# EAGLE design tinyfoc_dual (EAGLE 9.6.2)
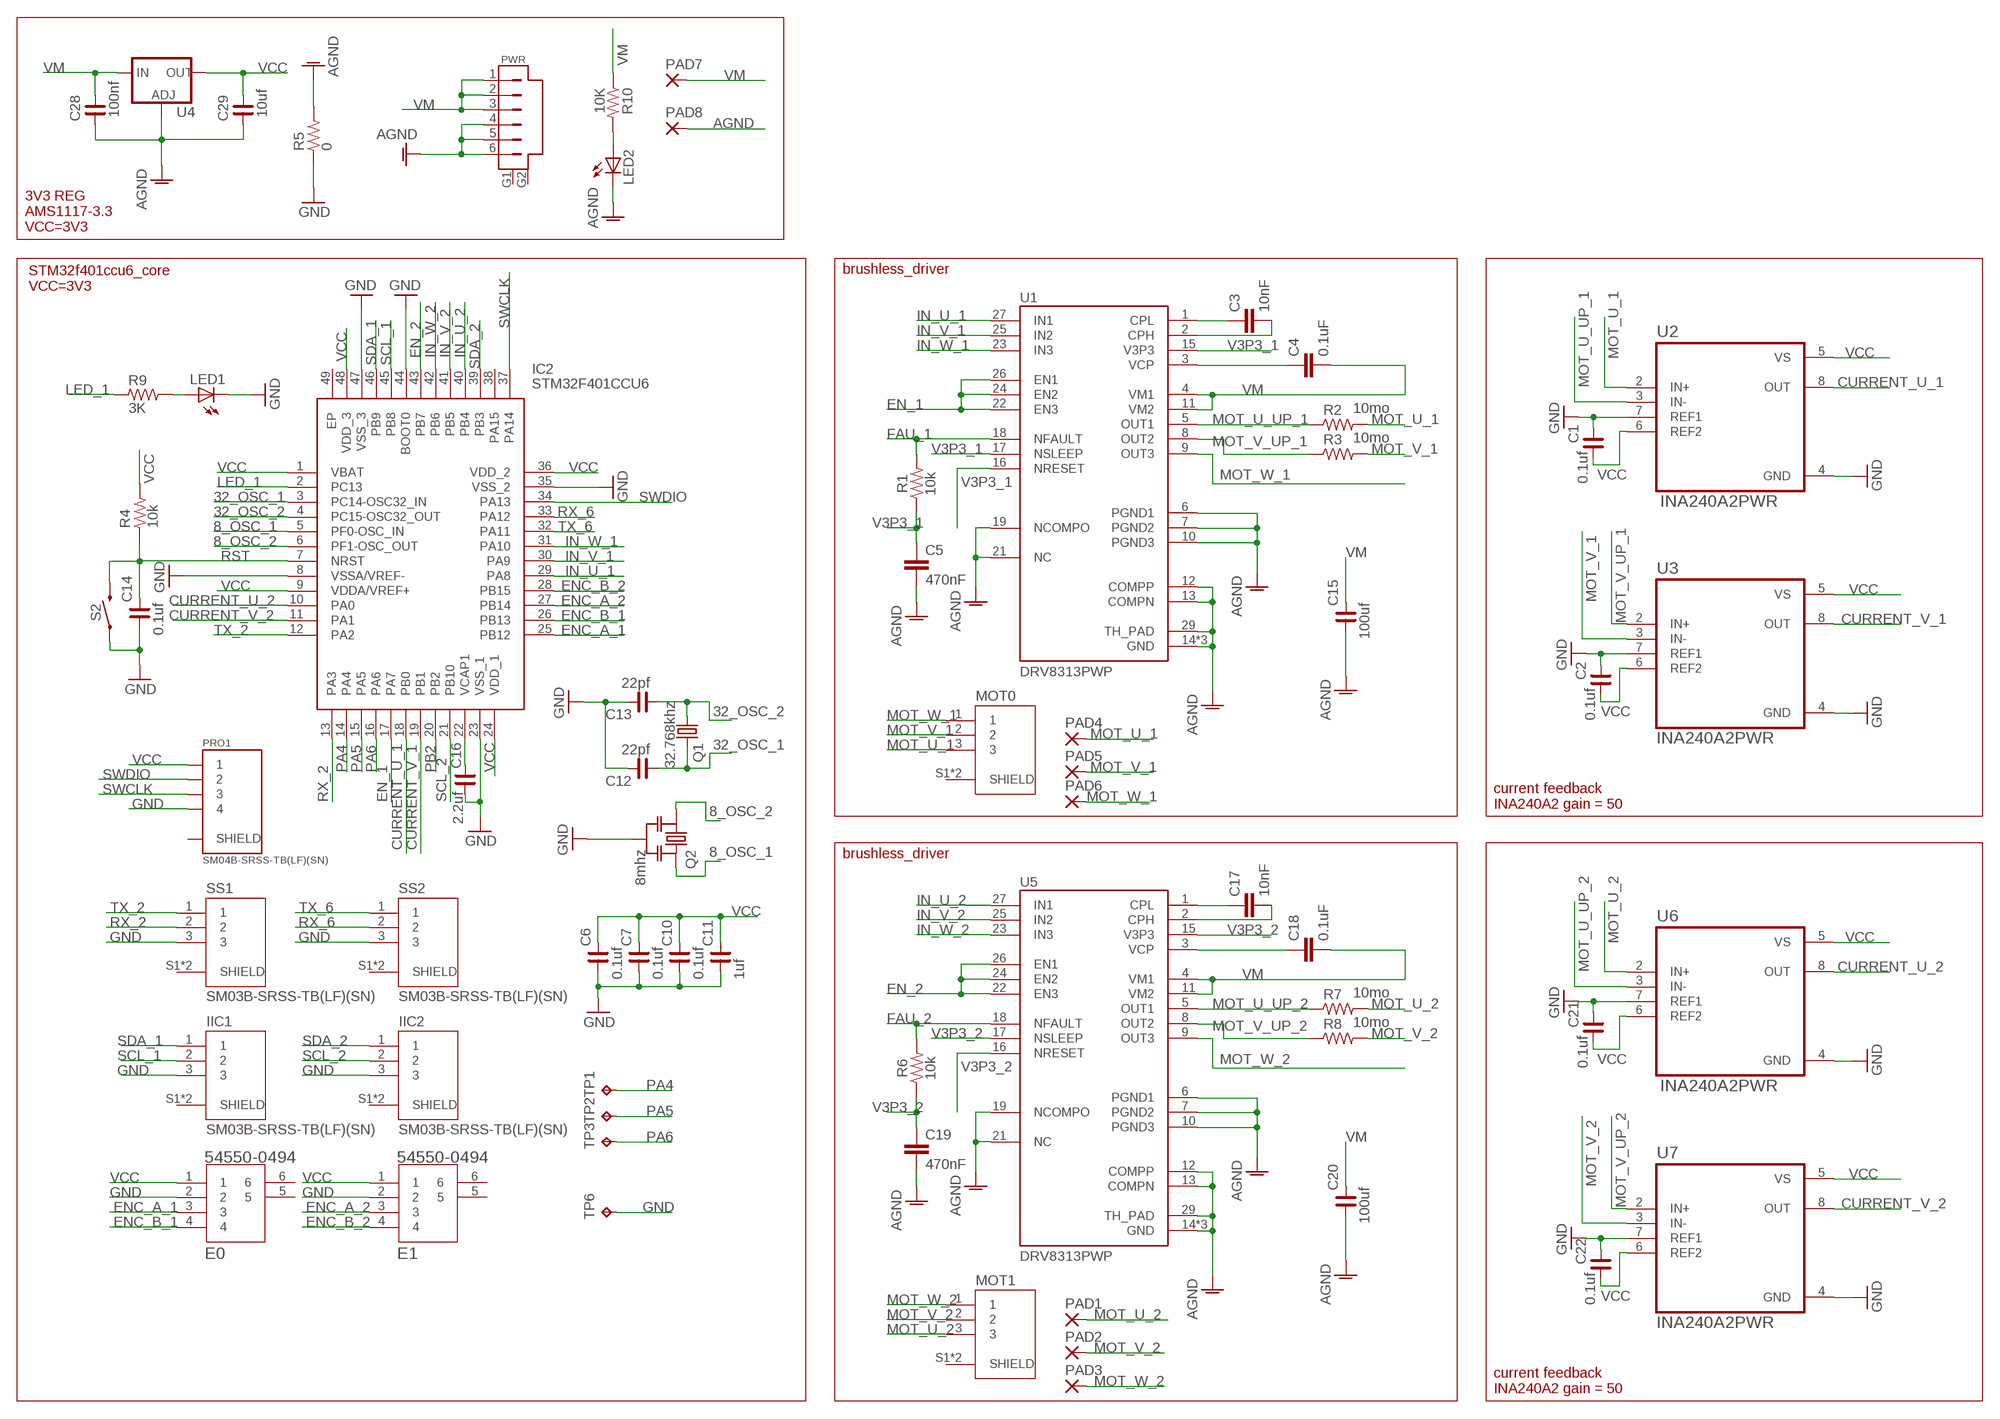
[diagram p0: schematic, sheet 1]

## Parts
C1  0.1uf  C_0603  [C0603]
C2  0.1uf  C_0603  [C0603]
C3  10nF  10NF-0603-50V-10%  [0603]
C4  0.1uF  0.1UF-0603-25V-(+80/-20%)  [0603]
C5  470nF  470NF-0603-10V-10%-X5R  [0603]
C6  0.1uf  C_0603  [C0603]
C7  0.1uf  C_0603  [C0603]
C10  0.1uf  C_0603  [C0603]
C11  1uf  C_0603  [C0603]
C12  22pf  C_0603  [C0603]
C13  22pf  C_0603  [C0603]
C14  0.1uf  C_0603  [C0603]
C15  100uf  C_1206  [C1206]
C16  2.2uf  C_0603  [C0603]
C17  10nF  10NF-0603-50V-10%  [0603]
C18  0.1uF  0.1UF-0603-25V-(+80/-20%)  [0603]
C19  470nF  470NF-0603-10V-10%-X5R  [0603]
C20  100uf  C_1206  [C1206]
C21  0.1uf  C_0603  [C0603]
C22  0.1uf  C_0603  [C0603]
C28  100nf  C_0603  [C0603]
C29  10uf  C_0603  [C0603]
E0  54550-0494  [CON4_1X4_DRB2_MOL]
E1  54550-0494  [CON4_1X4_DRB2_MOL]
IC2  STM32F401CCU6  [QFN50P700X700X60-49N]
IIC1  SM03B-SRSS-TB(LF)(SN)  [JST_SM03B-SRSS-TB(LF)(SN)]
IIC2  SM03B-SRSS-TB(LF)(SN)  [JST_SM03B-SRSS-TB(LF)(SN)]
LED1  LEDCHIPLED_0603  [CHIPLED_0603]
LED2  LEDCHIPLED_0603  [CHIPLED_0603]
MOT0  SM03B-SRSS-TB(LF)(SN)  [JST_SM03B-SRSS-TB(LF)(SN)]
MOT1  SM03B-SRSS-TB(LF)(SN)  [JST_SM03B-SRSS-TB(LF)(SN)]
PAD1  SMD5  [SMD2,54-5,08]
PAD2  SMD5  [SMD2,54-5,08]
PAD3  SMD5  [SMD2,54-5,08]
PAD4  SMD5  [SMD2,54-5,08]
PAD5  SMD5  [SMD2,54-5,08]
PAD6  SMD5  [SMD2,54-5,08]
PAD7  SMD5  [SMD2,54-5,08]
PAD8  SMD5  [SMD2,54-5,08]
PRO1  SM04B-SRSS-TB(LF)(SN)  [JST_SM04B-SRSS-TB(LF)(SN)]
PWR  SM06B-SRSS-TB  [SM06B]
Q1  32.768khz  KX-327-NHF  [3.2X1.5]
Q2  8mhz  RESONATOR-MURATACST_CE  [RESONATOR_MURATA2]
R1  10k  10KOHM-0603-1/10W-1%  [0603]
R2  10mo  R_1206  [R1206]
R3  10mo  R_1206  [R1206]
R4  10k  R_0603  [R0603]
R5  0  R_0603  [R0603]
R6  10k  10KOHM-0603-1/10W-1%  [0603]
R7  10mo  R_1206  [R1206]
R8  10mo  R_1206  [R1206]
R9  3K  R_0603  [R0603]
R10  10K  R_0603  [R0603]
S2  MOMENTARY-SWITCH-SPST-SMD-RIGHT-ANGLE  [TACTILE_SWITCH_SMD_RIGHT_ANGLE]
SS1  SM03B-SRSS-TB(LF)(SN)  [JST_SM03B-SRSS-TB(LF)(SN)]
SS2  SM03B-SRSS-TB(LF)(SN)  [JST_SM03B-SRSS-TB(LF)(SN)]
TP1  TPTP14SQ  [TP14SQ]
TP2  TPTP14SQ  [TP14SQ]
TP3  TPTP14SQ  [TP14SQ]
TP6  TPTP14SQ  [TP14SQ]
U1  DRV8313PWP  [SOP28P65_970X640X120L60X24T483X275N]
U2  INA240A2PWR  [SOP65P640X120-8N]
U3  INA240A2PWR  [SOP65P640X120-8N]
U4  V_REG_LM1117SOT223  [SOT223]
U5  DRV8313PWP  [SOP28P65_970X640X120L60X24T483X275N]
U6  INA240A2PWR  [SOP65P640X120-8N]
U7  INA240A2PWR  [SOP65P640X120-8N]

## Nets
8_OSC_1: IC2.5(PF0-OSC_IN) Q2.3
8_OSC_2: IC2.6(PF1-OSC_OUT) Q2.1
32_OSC_1: C12.1 IC2.3(PC14-OSC32_IN) Q1.2
32_OSC_2: C13.1 IC2.4(PC15-OSC32_OUT) Q1.1
AGND: C5.2 C15.1 C19.2 C20.1 C28.1 C29.1 LED2.C PAD8.1(P) PWR.4 PWR.5 PWR.6 R5.2 U1.6(PGND1) U1.7(PGND2) U1.10(PGND3) U1.12(COMPP) U1.13(COMPN) U1.14(GND) U1.19(NCOMPO) U1.20(GND) U1.21(NC) U1.28(GND) U1.29(TH_PAD) U4.1(ADJ) U5.6(PGND1) U5.7(PGND2) U5.10(PGND3) U5.12(COMPP) U5.13(COMPN) U5.14(GND) U5.19(NCOMPO) U5.20(GND) U5.21(NC) U5.28(GND) U5.29(TH_PAD)
CURRENT_U_1: IC2.18(PB0) U2.8(OUT)
CURRENT_U_2: IC2.10(PA0) U6.8(OUT)
CURRENT_V_1: IC2.19(PB1) U3.8(OUT)
CURRENT_V_2: IC2.11(PA1) U7.8(OUT)
EN_1: IC2.17(PA7) U1.22(EN3) U1.24(EN2) U1.26(EN1)
EN_2: IC2.43(PB7) U5.22(EN3) U5.24(EN2) U5.26(EN1)
ENC_A_1: E0.3 IC2.25(PB12)
ENC_A_2: E1.3 IC2.27(PB14)
ENC_B_1: E0.4 IC2.26(PB13)
ENC_B_2: E1.4 IC2.28(PB15)
FAU_1: R1.2 U1.18(NFAULT)
FAU_2: R6.2 U5.18(NFAULT)
GND: C1.2 C2.2 C6.1 C7.1 C10.1 C11.1 C12.2 C13.2 C14.1 C16.1 C21.2 C22.2 E0.2 E1.2 IC2.8(VSSA/VREF-) IC2.23(VSS_1) IC2.35(VSS_2) IC2.44(BOOT0) IC2.47(VSS_3) IIC1.3 IIC2.3 LED1.C PRO1.4 Q2.2 R5.1 S2.1 SS1.3 SS2.3 TP6.TP U2.4(GND) U2.7(REF1) U3.4(GND) U3.7(REF1) U6.4(GND) U6.7(REF1) U7.4(GND) U7.7(REF1)
IN_U_1: IC2.29(PA8) U1.27(IN1)
IN_U_2: IC2.40(PB4) U5.27(IN1)
IN_V_1: IC2.30(PA9) U1.25(IN2)
IN_V_2: IC2.41(PB5) U5.25(IN2)
IN_W_1: IC2.31(PA10) U1.23(IN3)
IN_W_2: IC2.42(PB6) U5.23(IN3)
LED_1: IC2.2(PC13) R9.1
MOT_U_1: MOT0.3 PAD4.1(P) R2.2 U2.2(IN+)
MOT_U_2: MOT1.3 PAD1.1(P) R7.2 U6.2(IN+)
MOT_U_UP_1: R2.1 U1.5(OUT1) U2.3(IN-)
MOT_U_UP_2: R7.1 U5.5(OUT1) U6.3(IN-)
MOT_V_1: MOT0.2 PAD5.1(P) R3.2 U3.3(IN-)
MOT_V_2: MOT1.2 PAD2.1(P) R8.2 U7.3(IN-)
MOT_V_UP_1: R3.1 U1.8(OUT2) U3.2(IN+)
MOT_V_UP_2: R8.1 U5.8(OUT2) U7.2(IN+)
MOT_W_1: MOT0.1 PAD6.1(P) U1.9(OUT3)
MOT_W_2: MOT1.1 PAD3.1(P) U5.9(OUT3)
N$1: C16.2 IC2.22(VCAP1)
N$2: C17.1 U5.1(CPL)
N$3: C3.1 U1.1(CPL)
N$4: C3.2 U1.2(CPH)
N$5: C4.1 U1.3(VCP)
N$6: LED2.A R10.2
N$7: C17.2 U5.2(CPH)
N$8: C18.1 U5.3(VCP)
N$9: LED1.A R9.2
PA4: IC2.14(PA4) TP1.TP
PA5: IC2.15(PA5) TP2.TP
PA6: IC2.16(PA6) TP3.TP
PB2: IC2.20(PB2)
RST: C14.2 IC2.7(NRST) R4.1 S2.2
RX_2: IC2.13(PA3) SS1.2
RX_6: IC2.33(PA12) SS2.2
SCL_1: IC2.45(PB8) IIC1.2
SCL_2: IC2.21(PB10) IIC2.2
SDA_1: IC2.46(PB9) IIC1.1
SDA_2: IC2.39(PB3) IIC2.1
SWCLK: IC2.37(PA14) PRO1.3
SWDIO: IC2.34(PA13) PRO1.2
TX_2: IC2.12(PA2) SS1.1
TX_6: IC2.32(PA11) SS2.1
V3P3_1: C5.1 R1.1 U1.15(V3P3) U1.16(NRESET) U1.17(NSLEEP)
V3P3_2: C19.1 R6.1 U5.15(V3P3) U5.16(NRESET) U5.17(NSLEEP)
VCC: C1.1 C2.1 C6.2 C7.2 C10.2 C11.2 C21.1 C22.1 C29.2 E0.1 E1.1 IC2.1(VBAT) IC2.9(VDDA/VREF+) IC2.24(VDD_1) IC2.36(VDD_2) IC2.48(VDD_3) PRO1.1 R4.2 U2.5(VS) U2.6(REF2) U3.5(VS) U3.6(REF2) U4.2(OUT) U4.4(OUT) U6.5(VS) U6.6(REF2) U7.5(VS) U7.6(REF2)
VM: C4.2 C15.2 C18.2 C20.2 C28.2 PAD7.1(P) PWR.1 PWR.2 PWR.3 R10.1 U1.4(VM1) U1.11(VM2) U4.3(IN) U5.4(VM1) U5.11(VM2)
Unconnected: E0.5 E0.6 E1.5 E1.6 IC2.38(PA15) IC2.49(EP) IIC1.S1(SHIELD) IIC1.S2(SHIELD) IIC2.S1(SHIELD) IIC2.S2(SHIELD) MOT0.S1(SHIELD) MOT0.S2(SHIELD) MOT1.S1(SHIELD) MOT1.S2(SHIELD) PRO1.S1(SHIELD) PRO1.S2(SHIELD) PWR.G1 PWR.G2 SS1.S1(SHIELD) SS1.S2(SHIELD) SS2.S1(SHIELD) SS2.S2(SHIELD)

## Notes on the sheet
- 3V3 REG
  AMS1117-3.3
  VCC=3V3
- brushless_driver
- STM32f401ccu6_core
  VCC=3V3
- current feedback
  INA240A2 gain = 50
- brushless_driver
- current feedback
  INA240A2 gain = 50

## Library data of the parts
C1 C2 C6 C7 C10-C16 C20-C22 C28 C29 = rc-master-smd:C_: NON-POLARIZED CAP
C3 C17 = SparkFun-Capacitors:10NF: 0.01uF/10nF/10,000pF ceramic capacitors A capacitor is a passive two-terminal electrical component used to store electrical energy temporarily in an electric field. CAP-09321; PROD_ID: CAP-00867
C4 C18 = SparkFun-Capacitors:0.1UF: 0.1µF ceramic capacitors A capacitor is a passive two-terminal electrical component used to store electrical energy temporarily in an electric field.; PROD_ID: CAP-00810
C5 C19 = SparkFun-Capacitors:470NF: 0.47uF/470nF ceramic capacitors A capacitor is a passive two-terminal electrical component used to store electrical energy temporarily in an electric field.; PROD_ID: CAP-13216
E0 E1 = fpc_4p_0.5:54550-0494; BUILT_BY: EMA_UL_Team; MANUFACTURER_PART_NUMBER: 54550-0494; SOURCELIBRARY: Molex_2010-01-01; VENDOR: Molex Connector Corporation
IC2 = STM32F401CCU6:STM32F401CCU6: 32-Bit MCU Cortex-M4 256KB 1.8V UFQFPN48 STMicroelectronics STM32F401CCU6, 32bit ARM Cortex M4 MCU, 84MHz, 256 kB Flash, 48-Pin UFQFPN Source: Datasheet <http://www.st.com/web/en/resource/technical/document/datasheet/DM00086815.pdf>; ARROW_PART_NUMBER: STM32F401CCU6; ARROW_PRICE-STOCK: https://www.arrow.com/en/products/stm32f401ccu6/stmicroelectronics?region=nac; DESCRIPTION: 32-Bit MCU Cortex-M4 256KB 1.8V UFQFPN48 STMicroelectronics STM32F401CCU6, 32bit ARM Cortex M4 MCU, 84MHz, 256 kB Flash, 48-Pin UFQFPN; HEIGHT: 0.6mm; MANUFACTURER_NAME: STMicroelectronics; MANUFACTURER_PART_NUMBER: STM32F401CCU6; MOUSER_PART_NUMBER: 511-STM32F401CCU6; MOUSER_PRICE-STOCK: https://www.mouser.co.uk/ProductDetail/STMicroelectronics/STM32F401CCU6?qs=DqCdCwOw4%2F5VrOZQxO795A%3D%3D
IIC1 IIC2 MOT0 MOT1 SS1 SS2 = SM03B-SRSS-TB_LF__SN_:SM03B-SRSS-TB(LF)(SN): SH Series 3 Position 1 mm Pitch Surface Mount Side Entry Shrouded Header; AVAILABILITY: Unavailable; DESCRIPTION: Connector Header Surface Mount, Right Angle 3 position 0.039 _1.00mm_; MF: JST Sales; MP: SM03B-SRSS-TB_LF__SN_; PACKAGE: None; PRICE: None
LED1 LED2 = adafruit:LED: LED OSRAM: - CHIPLED LG R971, LG N971, LY N971, LG Q971, LY Q971, LO R971, LY R971 LH N974, LH R974 LS Q976, LO Q976, LY Q976 LO Q996 - Hyper CHIPLED LW Q18S LB Q993, LB Q99A, LB R99A - SideLED LS A670, LO A670, LY A670, LG A670, LP A670 LB A673, LV A673, LT A673, LW A673 LH A674 LY A675 LS A676, LA A676, LO A676, LY A676, LW A676 LS A679, LY A679, LG A679 - Hyper Micro SIDELED® LS Y876, LA Y876, LO Y876, LY Y876 LT Y87S - SmartLED LW L88C, LW L88S LB L89C, LB L89S, LG L890 LS L89K, LO L89K, LY L89K LS L896, LA L896, LO L896, LY L896 - TOPLED LS T670, LO T670, LY T670, LG T670, LP T670 LSG T670, LSP T670, LSY T670, LOP T670, LYG T670 LG T671, LOG T671, LSG T671 LB T673, LV T673, LT T673, LW T673 LH T674 LS T676, LA T676, LO T676, LY T676, LB T676, LH T676, LSB T676, LW T676 LB T67C, LV T67C, LT T67C, LS T67K, LO T67K, LY T67K, LW E67C LS E67B, LA E67B, LO E67B, LY E67B, LB E67C, LV E67C, LT E67C LW T67C LS T679, LY T679, LG T679 LS T770, LO T770, LY T770, LG T770, LP T770 LB T773, LV T773, LT T773, LW T773 LH T774 LS E675, LA E675, LY E675, LS T675 LS T776, LA T776, LO T776, LY T776, LB T776 LHGB T686 LT T68C, LB T68C - Hyper Mini TOPLED® LB M676 - Mini TOPLED Santana® LG M470 LS M47K, LO M47K, LY M47K Source: http://www.osram.convergy.de/
PAD1-PAD8 = wirepad:SMD5: SMD PAD
PRO1 = SM04B-SRSS-TB_LF__SN_:SM04B-SRSS-TB(LF)(SN): SH Series 1.0 mm Pitch 2 Position Single Row Side Entry Shrouded Header Check prices <https://snapeda.com/parts/SM04B-SRSS-TB%28LF%29%28SN%29/JST%20Sales/view-part/?ref=eda>; ARROW_EUROPE-PURCHASE-URL: https://snapeda.com/shop?store=Arrow+Europe&id=557466; AVAILABILITY: Good; DESCRIPTION: Connector Header Surface Mount, Right Angle 4 position 0.039 (1.00mm); DIGIKEY-PURCHASE-URL: https://snapeda.com/shop?store=DigiKey&id=557466; MF: JST Sales; MP: SM04B-SRSS-TB(LF)(SN); PACKAGE: None; PRICE: None
PWR = SM06B-SRSS-TB:SM06B-SRSS-TB: CONN HEADER SH 6POS SIDE 1MM TIN Check prices <https://snapeda.com/parts/SM06B-SRSS-TB/JST%20Sales/view-part/?ref=eda>; AVAILABILITY: Bad; DESCRIPTION: Connector Header Surface Mount, Right Angle 6 position 0.039 (1.00mm); MF: JST Sales; MP: SM06B-SRSS-TB; PACKAGE: None; PRICE: None
Q1 = crystal-geyer_V1_0:KX-327: Tuning Fork Crystals (kHz) SMD: KX327 - Serie Model Size l/w/h [mm] Frequency Range Frequency Stability Temp. Range [°C] Load Capacitance AECQ 200 availabel Datasheet KX-327VT KX-327FT KX-327RT KX-327NHT KX-327NHF KX-327L KX-327S 1.25/1.05/0.5 1.6/1.0/0.5 2.0/1.2/0.6 3.2/1.5/0.8 3.2/1.5/0.8 7.0/1.5/1.4 8.2/3.8/2.5 32,768 kHz 32,768 kHz 32,768 kHz 32,768 kHz 32,768 kHz 32,768 kHz 32,768 kHz ±10 … ±20ppm ±10 … ±20ppm ±10 … ±20ppm ±10 … ±20ppm ±10 … ±20ppm ±10 … ±20ppm ±5 … ±20ppm (*) -40°C …+85°C (*) -40°C …+85°C (*) -40°C …+85°C (*) -40°C …+85°C (*) -40°C …+125°C (*) -40°C …+85°C (*) -40°C …+85°C 7/9/12,5 7/9/12,5 7/9/12,6 7/9/12,5 9/12,5 7/9/12,5 6/12,5 - - - - yes - - KX-327VT.pdf <http://www.geyer-electronic.de/uploads/tx_userartikelfrequenz/GEYER-KX-327VT.pdf> KX-327FT.pdf <http://www.geyer-electronic.de/uploads/tx_userartikelfrequenz/GEYER-KX-327FT.pdf> KX-327RT.pdf <http://www.geyer-electronic.de/uploads/tx_userartikelfrequenz/GEYER-KX-327RT.pdf> KX-327NHT.pdf <http://www.geyer-electronic.de/uploads/tx_userartikelfrequenz/GEYER-KX-327NHT.pdf> KX-327NHF.pdf <http://www.geyer-electronic.de/uploads/tx_userartikelfrequenz/GEYER-KX-327NHF.pdf> KX-327L.pdf <http://www.geyer-electronic.de/uploads/tx_userartikelfrequenz/GEYER-KX-327L.pdf> KX-327S.pdf <http://www.geyer-electronic.de/uploads/tx_userartikelfrequenz/GEYER-KX-327S.pdf> <http://www.geyer-electronic.de/fileadmin/template/img/logo-geyer-electronic.png> Details see: http://www.geyer-electronic.de/Frequenz-Produkte.9.0.html Created 2016-06-07, Hans Locher 2016 (C) Geyer Quartz Technology KX327VT,KX327FT,KX327RT,KX327NHT,KX327NHF,KX327S,KX327L;125105;1610;2012;3215;7015;8238;1,25x1,05,1.25x1.05;1,6x1,0,1.6x1.0;2,0x1,2,2.0x1.2;3,2x1,5,3.2x1.5;8,2x3,8,8.2x3.8,7.0x1.5,7,0x1,532.768kHz
Q2 = m-pad-2.1:RESONATOR-MURATA: Murata ceramic Resonator "ceralock" CSTCE series with built in load capacitance +- 0.5% tolerance 12.51MHz to 19.99MHz 16MHz murata part#: CSTCE16M0V53-R0 16MHz digikey part#: 490-1198-1-ND $1.33 each
R1 R6 = SparkFun-Resistors:10KOHM: 10kΩ resistor A resistor is a passive two-terminal electrical component that implements electrical resistance as a circuit element. Resistors act to reduce current flow, and, at the same time, act to lower voltage levels within circuits. - Wikipedia; PROD_ID: RES-00824
R2-R5 R7-R10 = rc-master-smd:R_: RESISTOR
S2 = SparkFun-Switches:MOMENTARY-SWITCH-SPST: Momentary Switch (Pushbutton) - SPST Normally-open (NO) SPST momentary switches (buttons, pushbuttons). Variants PTH-12MM - 12mm square, through-hole Momentary Pushbutton Switch - 12mm Square <https://www.sparkfun.com/products/9190> (COM-09190) PTH-6.0MM, PTH-6.0MM-KIT - 6.0mm square, through-hole Mini Pushbutton Switch <https://www.sparkfun.com/products/97> (COM-00097) KIT package intended for soldering kit's - only one side of pads' copper is exposed. PTH-RIGHT-ANGLE-KIT - Right-angle, through-hole Right Angle Tactile Button <https://www.sparkfun.com/products/10791> - Used on SparkFun BigTime Watch Kit <https://www.sparkfun.com/products/11734> SMD-12MM - 12mm square, surface-mount Tactile Button - SMD (12mm) <https://www.sparkfun.com/products/12993> (COM-12993) Used on SparkFun PicoBoard <https://www.sparkfun.com/products/11888> SMD-4.5MM - 4.5mm Square Trackball Switch Used on SparkFun Blackberry Trackballer Breakout <https://www.sparkfun.com/products/13169> SMD-4.6MMX2.8MM - 4.60mm x 2.80mm, surface mount Used on SparkFun SAMD21 Mini Breakout <https://www.sparkfun.com/products/13664> SMD-5.2MM, SMD-5.2-REDUNDANT - 5.2mm square, surface-mount Mini Pushbutton Switch - SMD <https://www.sparkfun.com/products/8720> (COM-08720) Used on Arduino Pro Mini <https://www.sparkfun.com/products/11114> REDUNDANT package connects both switch circuits together SMD-6.0X3.5MM - 6.0 x 3.5mm, surface mount Momentary Reset Switch SMD <https://www.sparkfun.com/products/8229> (COM-08229) SMD-6.2MM-TALL - 6.2mm square, surface mount Tactile Button - SMD (6mm) <https://www.sparkfun.com/products/12992> Used on SparkFun Digital Sandbox <https://www.sparkfun.com/products/12651> SMD-RIGHT-ANGLE - Right-angle, surface mount Used on SparkFun Block for Intel® Edison - Arduino <https://www.sparkfun.com/products/13036>; PROD_ID: COMP-12265
TP1-TP3 TP6 = testpad:TP: Test pad
U1 U5 = DRV8313PWP:DRV8313PWP: 2.5A Three Phase Brushless DC Motor Driver (PWM Ctrl) 28-HTSSOP -40 to 85; DESCRIPTION: 2.5A Three Phase Brushless DC Motor Driver _PWM Ctrl_ 28-HTSSOP -40 to 85; DIGI-KEY_PART_NUMBER: 296-35540-5-ND; DIGI-KEY_PURCHASE_URL: https://www.digikey.com.cn/product-detail/zh/texas-instruments/DRV8313PWP/296-35540-5-ND/3790947?utm_source=snapeda&utm_medium=aggregator&utm_campaign=symbol; MF: Texas Instruments; MP: DRV8313PWP; PACKAGE: HTSSOP-28 Texas Instruments
U2 U3 U6 U7 = INA240A2PWR:INA240A2PWR: Check prices <https://pricing.snapeda.com/parts/INA240A2PWR/Texas%20Instruments/view-part?ref=eda>; AVAILABILITY: In Stock; DESCRIPTION: -4 to 80V, bidirectional, ultra-precise current sense amplifier with enhanced PWM rejection 8-TSSOP -40 to 125; MF: Texas Instruments; MP: INA240A2PWR; PACKAGE: TSSOP-8 Texas Instruments; PRICE: None; PURCHASE-URL: https://pricing.snapeda.com/search/part/INA240A2PWR/?ref=eda
U4 = SparkFun-IC-Power:V_REG_LM1117: Voltage Regulator LM1117 Standard adjustable voltage regulator but in SMD form. Spark Fun Electronics SKU : COM-00595; PROD_ID: VREG-08170

## Net classes
0 default: width 0.203 mm
1 vcc: width 0.254 mm

## Board
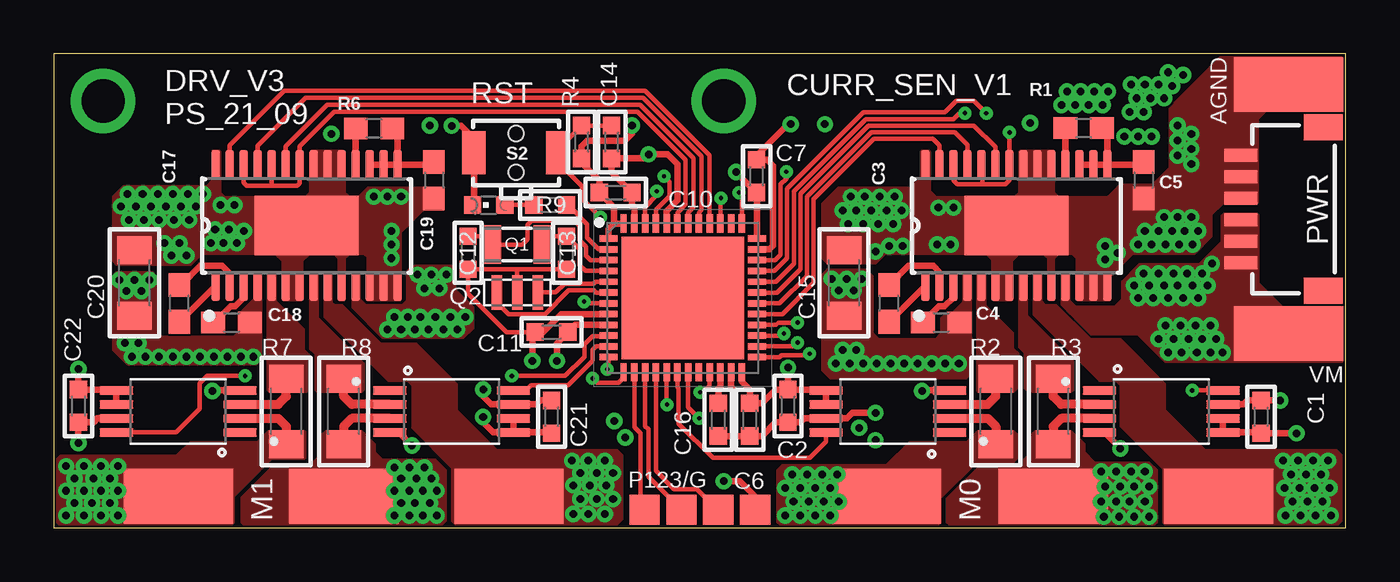
[diagram p1: board, top side]
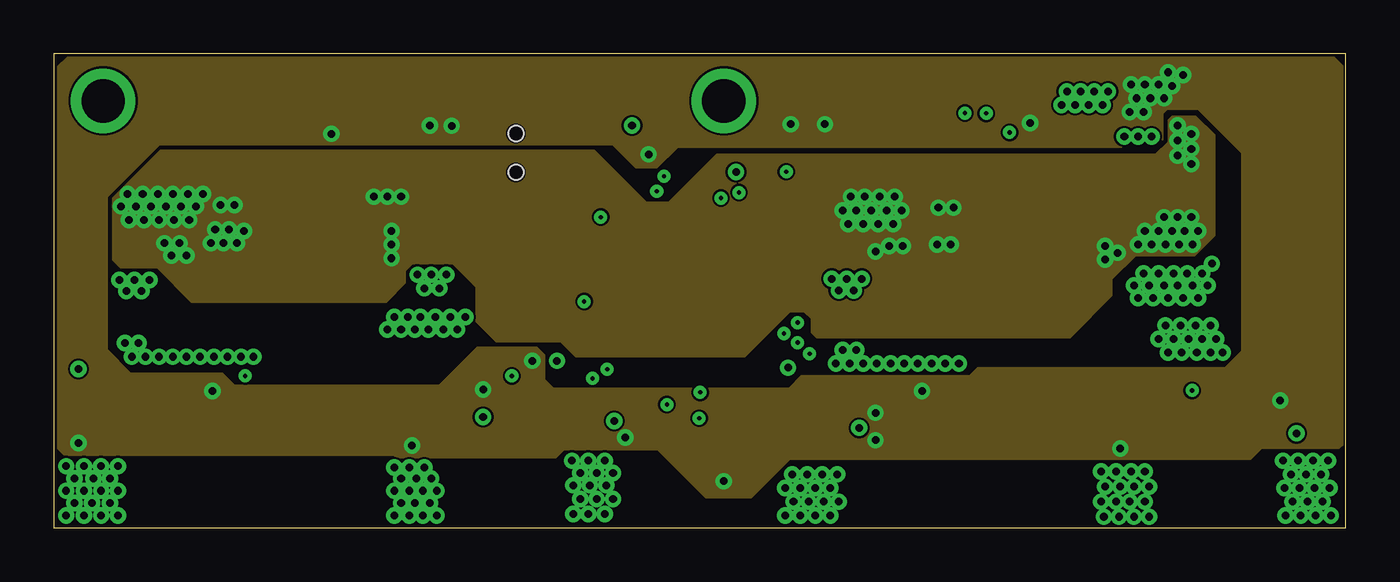
[diagram p2: board, inner layer Route2]
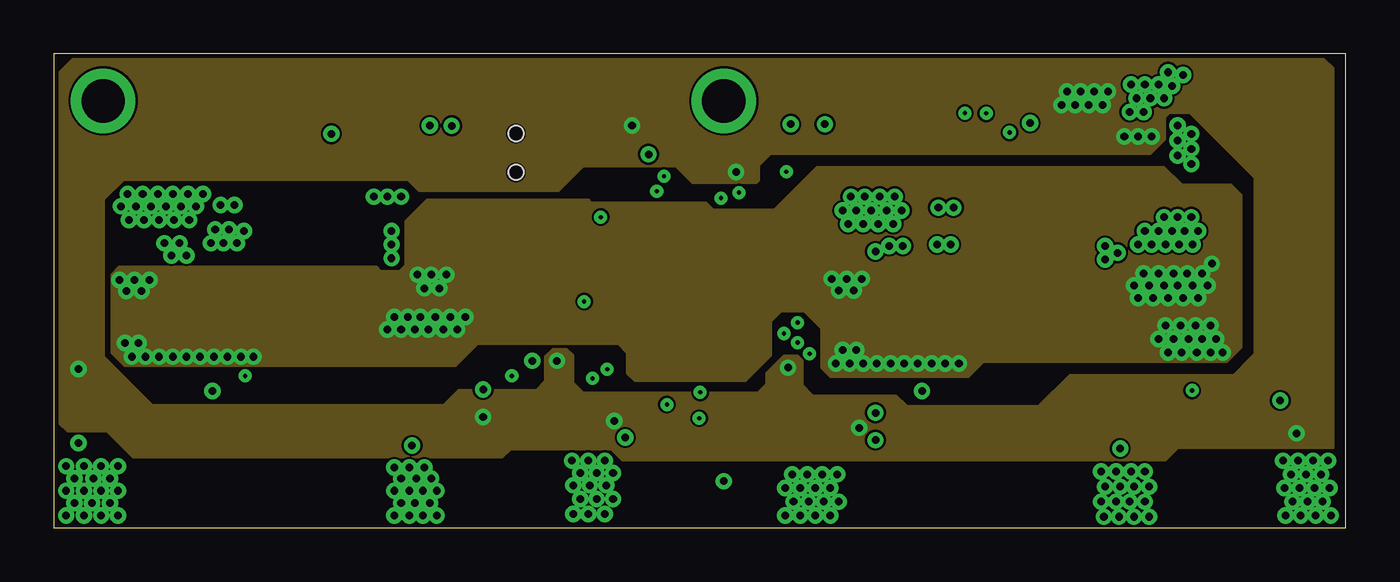
[diagram p3: board, inner layer Route15]
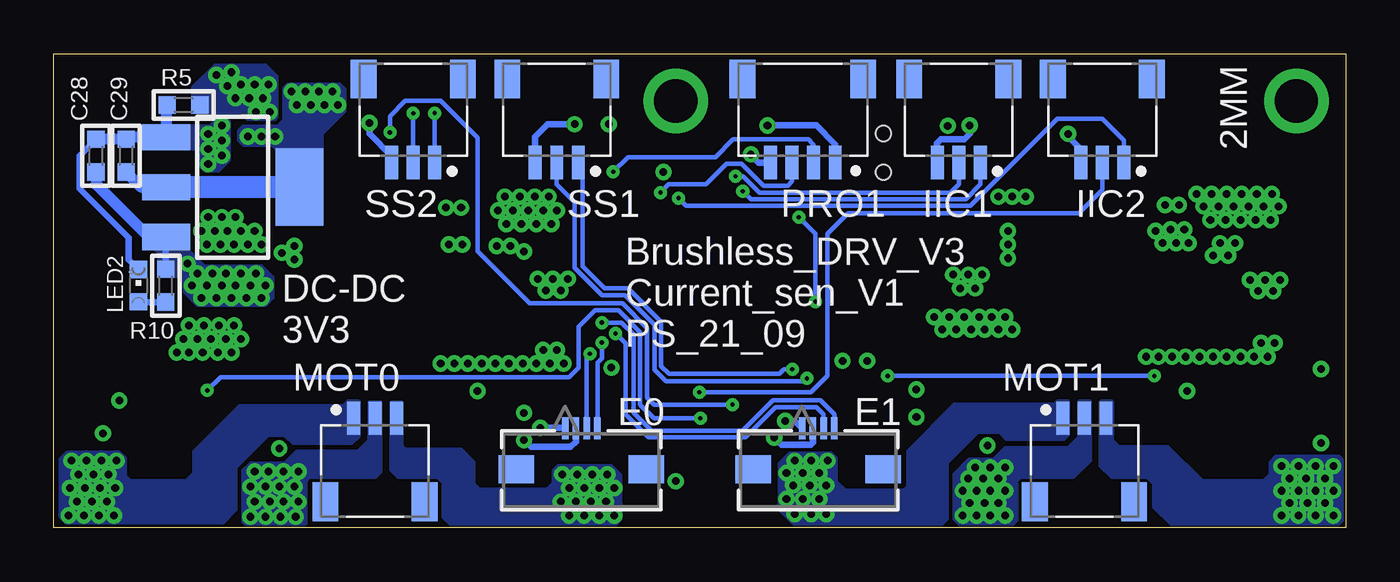
[diagram p4: board, bottom side, seen from below]

Size 60 x 22 mm. Coordinates in mm from the lower left corner, seen from the top.
Outline: 0,0 60,0 60,22 0,22 0,0
Copper layers (1+2*15+16): Top 0.035mm / dielectric 1.5mm / Route2 0.035mm / dielectric 0.15mm / Route15 0.035mm / dielectric 0.2mm / Bottom 0.035mm
Design rules "default *": minimum track width 4mil, minimum drill 0.35mm, track to track 4mil, track to pad 4mil, pad to pad 4mil, via to via 4mil, smd to smd 4mil, copper to edge 4mil, drill to drill 4mil, minimum pad ring 8mil, minimum via ring 8mil, stop-mask expansion 4mil, vias tented up to drill 20mil, thermal gap 10mil

### Footprints (pad centres in the part's own frame; a part is rotated, then mirrored left to right if it is on the bottom)
C0603 = smd 0.8 x 0.8: 1 -0.762,0; 2 0.762,0
0603 = smd 1.1 x 1: 1 -0.85,0; 2 0.85,0
C1206 = smd 1.3 x 1.6: 1 -1.524,0; 2 1.524,0
CON4_1X4_DRB2_MOL = smd 0.305 x 1.016: 1 0.75,-1.702; 2 0.25,-1.702; 3 -0.25,-1.702; 4 -0.75,-1.702 | smd 1.65 x 1.3: 5 -3.023,0.203; 6 3.023,0.203
QFN50P700X700X60-49N = smd 0.85 x 0.3: 1 -3.45,2.75; 2 -3.45,2.25; 3 -3.45,1.75; 4 -3.45,1.25; 5 -3.45,0.75; 6 -3.45,0.25; 7 -3.45,-0.25; 8 -3.45,-0.75; 9 -3.45,-1.25; 10 -3.45,-1.75; 11 -3.45,-2.25; 12 -3.45,-2.75; 25 3.45,-2.75; 26 3.45,-2.25; 27 3.45,-1.75; 28 3.45,-1.25; 29 3.45,-0.75; 30 3.45,-0.25; 31 3.45,0.25; 32 3.45,0.75; 33 3.45,1.25; 34 3.45,1.75; 35 3.45,2.25; 36 3.45,2.75 | smd 0.3 x 0.85: 13 -2.75,-3.45; 14 -2.25,-3.45; 15 -1.75,-3.45; 16 -1.25,-3.45; 17 -0.75,-3.45; 18 -0.25,-3.45; 19 0.25,-3.45; 20 0.75,-3.45; 21 1.25,-3.45; 22 1.75,-3.45; 23 2.25,-3.45; 24 2.75,-3.45; 37 2.75,3.45; 38 2.25,3.45; 39 1.75,3.45; 40 1.25,3.45; 41 0.75,3.45; 42 0.25,3.45; 43 -0.25,3.45; 44 -0.75,3.45; 45 -1.25,3.45; 46 -1.75,3.45; 47 -2.25,3.45; 48 -2.75,3.45 | smd 5.7 x 5.7: 49 0,0
JST_SM03B-SRSS-TB(LF)(SN) = smd 0.6 x 1.55: 1 -1,0; 2 0,0; 3 1,0 | smd 1.2 x 1.8: S1 -2.3,-3.875; S2 2.3,-3.875
CHIPLED_0603 = smd 0.8 x 0.8: A 0,-0.75; C 0,0.75
SMD2,54-5,08 = smd 2.54 x 5.08: 1 0,0
JST_SM04B-SRSS-TB(LF)(SN) = smd 0.6 x 1.55: 1 -1.5,0; 2 -0.5,0; 3 0.5,0; 4 1.5,0 | smd 1.2 x 1.8: S1 -2.8,-3.875; S2 2.8,-3.875
SM06B = smd 0.6 x 1.55: 1 -2.5,2.275; 2 -1.5,2.275; 3 -0.5,2.275; 4 0.5,2.275; 5 1.5,2.275; 6 2.5,2.275 | smd 1.2 x 1.8: G1 -3.8,-1.55; G2 3.8,-1.55
3.2X1.5 = smd 1 x 1.8: 1 -1.25,0; 2 1.25,0
RESONATOR_MURATA2 = smd 0.5 x 1.6: 1 -0.95,0; 2 0,0; 3 0.95,0
R1206 = smd 1.3 x 1.6: 1 -1.524,0; 2 1.524,0
R0603 = smd 0.8 x 0.8: 1 -0.762,0; 2 0.762,0
TACTILE_SWITCH_SMD_RIGHT_ANGLE = smd 1.1 x 2: 1 -1.95,0; 2 1.95,0 | hole 0.7: 0,0.9; 0,-0.9
TP14SQ = smd 1.4 x 1.4: TP 0,0
SOP28P65_970X640X120L60X24T483X275N = smd 1.37 x 0.39: 1 -2.82,4.225; 2 -2.82,3.575; 3 -2.82,2.925; 4 -2.82,2.275; 5 -2.82,1.625; 6 -2.82,0.975; 7 -2.82,0.325; 8 -2.82,-0.325; 9 -2.82,-0.975; 10 -2.82,-1.625; 11 -2.82,-2.275; 12 -2.82,-2.925; 13 -2.82,-3.575; 14 -2.82,-4.225; 15 2.82,-4.225; 16 2.82,-3.575; 17 2.82,-2.925; 18 2.82,-2.275; 19 2.82,-1.625; 20 2.82,-0.975; 21 2.82,-0.325; 22 2.82,0.325; 23 2.82,0.975; 24 2.82,1.625; 25 2.82,2.275; 26 2.82,2.925; 27 2.82,3.575; 28 2.82,4.225 | smd 2.75 x 4.83: 29 0,0
SOP65P640X120-8N = smd 1.57 x 0.41: 1 -2.87,0.975; 2 -2.87,0.325; 3 -2.87,-0.325; 4 -2.87,-0.975; 5 2.87,-0.975; 6 2.87,-0.325; 7 2.87,0.325; 8 2.87,0.975
SOT223 = smd 1.219 x 2.235: 1 -2.311,-3.099; 2 0,-3.099; 3 2.311,-3.099 | smd 3.6 x 2.2: 4 0,3.099

### Placement (x,y rotation side)
C1  56.07,5.14 90 top
C2  34.1,5.65 270 top
C3  38.8,10.41 90 top
C4  41.21,9.53 0 top
C5  50.61,16.13 270 top
C6  32.32,5.02 90 top
C7  32.64,16.32 270 top
C10  26.1,15.56 180 top
C11  23.11,9.08 0 top
C12  19.24,12.76 270 top
C13  23.81,12.76 270 top
C14  25.91,17.91 90 top
C15  36.7,11.37 270 top
C16  30.86,5.02 90 top
C17  5.84,10.41 90 top
C18  8.26,9.53 0 top
C19  17.65,16.13 270 top
C20  3.75,11.37 270 top
C21  23.11,5.14 90 top
C22  1.14,5.65 270 top
C28  58.04,17.27 270 bottom
C29  56.64,17.27 270 bottom
E0  35.5,2.92 180 bottom
E1  24.5,2.92 180 bottom
IC2  29.21,10.67 0 top
IIC1  17.97,16.95 180 bottom
IIC2  11.3,16.95 180 bottom
LED1  20.19,14.99 90 top
LED2  56.07,11.24 0 bottom
MOT0  45.09,5.08 0 bottom
MOT1  12.13,5.08 0 bottom
PAD1  5.78,1.46 90 top
PAD2  13.46,1.46 90 top
PAD3  21.15,1.46 90 top
PAD4  38.67,1.46 90 top
PAD5  46.42,1.46 90 top
PAD6  54.1,1.46 90 top
PAD7  57.34,9.02 90 top
PAD8  57.34,20.57 90 top
PRO1  25.21,16.95 180 bottom
PWR  57.4,14.8 90 top
Q1  21.53,13.14 180 top
Q2  21.53,10.92 0 top
R1  47.83,18.55 180 top
R2  43.75,5.4 270 top
R3  46.42,5.4 270 top
R4  24.51,17.91 270 top
R5  53.98,19.62 180 bottom
R6  14.87,18.54 180 top
R7  10.79,5.4 270 top
R8  13.46,5.4 270 top
R9  23.05,14.99 180 top
R10  54.8,11.24 270 bottom
S2  21.46,17.4 0 top
SS1  36.64,16.95 180 bottom
SS2  43.31,16.95 180 bottom
TP1  27.43,0.83 0 top
TP2  29.15,0.83 0 top
TP3  30.86,0.83 0 top
TP6  32.58,0.83 0 top
U1  44.7,14.03 90 top
U2  38.73,5.4 180 top
U3  51.44,5.4 0 top
U4  51.69,15.81 270 bottom
U5  11.75,14.03 90 top
U6  5.78,5.4 180 top
U7  18.48,5.4 0 top

### Tracks (layer width: path | path; a pad name or v marks a point on that pad's centre or on a via)
8_OSC_1
  Top 0.203: IC2.5 25.16,11.42 25.07,11.34 23.71,11.34 23.3,10.92 Q2.3
8_OSC_2
  Top 0.203: Q2.1 20.58,10.47 21.13,9.92 22.81,9.92 23.91,11.02 25.08,11.02 25.19,10.92 IC2.6
32_OSC_1
  Top 0.203: C12.1 19.89,13.53 Q1.2 21.76,13.14 22.01,13.4 22.01,14.06 22.19,14.25 24.18,14.25 24.42,14.01 24.42,13.35 24.72,13.05 24.72,12.64 24.94,12.42 IC2.3
32_OSC_2
  Top 0.203: Q1.1 23.16,13.53 C13.1 24.42,12.92 24.42,12.19 24.69,11.92 IC2.4
AGND  (via drill 0.35)
  Bottom 0.305: LED2.C 56.52,12.43 56.52,13.46 58.8,15.75 58.8,17.27 C28.1
  Bottom 0.508: C28.1 C29.1 56.55,18.12 U4.1 54.79,19.57 R5.2
  other vias: 3.43,15.49 4.13,15.49 4.83,15.49 5.52,15.49 6.22,15.49 3.11,14.92 3.81,14.92 4.51,14.92 5.21,14.92 5.91,14.92 6.6,14.92 6.92,15.49 3.49,14.29 4.19,14.29 4.89,14.29 5.59,14.29 6.29,14.29 5.46,12.64 6.16,12.64 14.86,15.37 15.49,15.37 16.13,15.37 15.68,12.51 15.68,13.14 15.68,13.78 50.36,13.14 50.99,13.14 51.63,13.14 52.26,13.14 52.9,13.14 50.67,13.78 51.31,13.78 51.94,13.78 52.51,13.78 53.15,13.78 51.56,14.41 52.2,14.41 52.83,14.41 52.83,18.29 52.83,17.59 52.83,16.89 52.2,17.27 52.2,17.97 52.2,18.67 37.02,15.37 37.66,15.37 38.35,15.37 39.05,15.37 36.64,14.73 37.27,14.73 37.97,14.73 38.67,14.73 39.37,14.73 36.89,14.1 37.59,14.1 38.29,14.1 38.99,14.1 7.3,13.21 7.87,13.21 8.51,13.21 8.83,13.78 8.13,13.84 7.49,13.84 7.75,14.99 8.38,14.99 5.14,13.21 5.84,13.21 41.08,14.86 41.78,14.86 41.02,13.14 41.66,13.14 38.16,12.83 38.8,13.08 39.43,13.08 48.83,12.45 48.83,13.08 49.4,12.76
  pour Top (no thermals): 7.37,17.53 7.37,16.13 7.11,15.88 3.24,15.88 2.73,15.37 2.73,12.38 2.92,12.19 6.35,12.19 6.86,12.7 10.29,12.7 10.6,12.38 10.6,10.6 10.67,10.54 11.49,10.54 11.56,10.6 11.56,12.38 11.87,12.7 13.02,12.7 13.21,12.51 13.21,10.6 13.27,10.54 13.46,10.54 13.53,10.6 13.53,12.51 13.72,12.7 14.41,12.7 14.54,12.57 14.54,10.6 14.61,10.54 16.07,10.54 16.13,10.6 16.13,13.72 17.14,14.73 18.1,14.73 18.1,15.81 14.61,15.81 14.16,15.37 13.72,15.37 13.53,15.56 13.53,17.4 13.4,17.53 12,17.53 11.87,17.4 11.87,15.56 11.68,15.37 7.94,15.37 7.75,15.56 7.75,17.46 7.68,17.53
  pour Top (no thermals): 40.64,17.53 40.32,17.53 40.26,17.46 40.26,16.26 39.81,15.81 36.45,15.81 35.69,15.05 35.69,12.51 35.94,12.26 38.16,12.26 38.6,12.69 43.32,12.69 43.56,12.45 43.56,10.67 43.69,10.54 44.45,10.54 44.51,10.6 44.51,12.38 44.83,12.7 45.97,12.7 46.16,12.51 46.16,10.67 46.23,10.6 46.42,10.6 46.48,10.67 46.48,12.51 46.67,12.7 47.31,12.7 47.5,12.51 47.5,10.6 47.56,10.54 49.02,10.54 49.09,10.6 49.09,11.68 50.1,12.7 52.96,12.7 53.78,13.53 53.78,14.54 54.29,15.05 55.88,15.05 55.94,15.11 55.94,18.99 56.32,19.37 59.82,19.37 59.94,19.49 59.94,21.72 59.75,21.91 54.23,21.91 51.82,19.49 51.82,16.7 51.05,15.94 49.53,15.94 48.96,15.37 46.67,15.37 46.48,15.56 46.48,17.46 46.42,17.53 44.89,17.53 44.83,17.46 44.83,15.56 44.64,15.37 40.96,15.37 40.7,15.62 40.7,17.46
  pour Bottom (no thermals): 55.88,18.69 52.74,18.69 52.39,19.05 51.99,19.05 51.82,18.87 51.82,17.06 52.34,16.54 52.98,16.54 53.21,16.76 53.21,17.32 53.44,17.55 55.88,17.55
  pour Route2 (no thermals): 3.11,12.06 2.73,12.45 2.73,15.3 4.95,17.53 25.08,17.53 27.5,15.11 28.57,15.11 30.8,17.34 51.18,17.34 51.75,17.91 51.75,18.92 51.94,19.11 53.02,19.11 53.91,18.22 53.91,13.59 52.96,12.64 50.23,12.64 49.15,11.56 49.15,10.79 47.18,8.83 35.43,8.83 35.18,9.08 35.18,9.72 34.86,10.03 34.16,10.03 32.07,7.94 24.26,7.94 23.56,8.64 20.57,8.64 19.62,9.59 19.62,11.18 18.54,12.26 16.64,12.26 16.32,11.94 16.32,11.37 15.43,10.48 6.41,10.48 4.83,12.06
CURRENT_U_1
  Top 0.203: IC2.18 28.96,6.52 29.02,6.46 29.02,4.82 30.61,3.24 35.12,3.24 35.87,3.99 U2.8
CURRENT_U_2  (via drill 0.2)
  Top 0.203: IC2.10 25.73,8.89 25.02,8.89 24.64,8.51 24.64,7.94 23.75,7.05 v21.27,7.05 | U6.8 5.69,4.42 6.79,5.51 6.79,6.72 7.12,7.05 v8.89,7.05
  Bottom 0.203: v8.89,7.05 v21.27,7.05
CURRENT_V_1  (via drill 0.2)
  Top 0.203: IC2.19 29.46,5.59 v29.97,5.08 | U3.8 v52.87,6.37 v52.87,6.38
  Bottom 0.203: v29.97,5.08 32.13,5.08 32.77,5.71 32.77,9.09 33.78,10.1 34.86,10.1 35.62,9.34 35.62,7.43 36.07,6.99 52.26,6.99 v52.87,6.38
CURRENT_V_2
  Top 0.203: IC2.11 25.18,8.42 25.02,8.26 25.02,7.75 23.88,6.6 22.16,6.6 21.93,6.37 U7.8
EN_1  (via drill 0.2)
  Top 0.203: U1.26 41.78,16.13 41.97,15.94 43.12,15.94 | 43.12,15.94 44.2,15.94 44.39,16.13 U1.22 44.38,18.34 v44.39,18.35 | U1.24 43.12,16.82 43.12,15.94 | IC2.17 28.46,5.73 v28.48,5.71
  Bottom 0.203: v44.39,18.35 44.39,19.11 43.69,19.81 42.04,19.81 40.32,18.1 40.32,12.83 37.91,10.41 33.59,10.41 32.45,9.27 32.45,6.03 32.13,5.71 v28.48,5.71
EN_2
  Top 0.203: IC2.43 28.96,14.63 29.34,15.01 29.34,17.08 27.11,19.3 13.02,19.3 11.42,17.71 U5.22 11.42,15.99 11.3,15.88 10.12,15.88 | 10.12,15.88 8.95,15.88 8.82,16.01 U5.26 | U5.24 10.12,15.88
ENC_A_1  (via drill 0.2)
  Top 0.203: IC2.25 33.7,7.92 33.8,8.01 35.04,8.01 v35.1,8.08
  Bottom 0.203: E0.3 35.25,7.93 v35.1,8.08
ENC_A_2  (via drill 0.2)
  Top 0.203: IC2.27 33.81,8.92 v33.91,9.02
  Bottom 0.203: E1.3 24.26,5.27 24.57,5.59 26.48,5.59 27.88,4.19 32.38,4.19 33.45,5.26 33.45,8.56 v33.91,9.02
ENC_B_1  (via drill 0.2)
  Top 0.203: IC2.26 34.37,8.42 v34.54,8.59
  Bottom 0.203: E0.4 34.75,7.67 34.54,7.87 v34.54,8.59
ENC_B_2  (via drill 0.2)
  Top 0.203: IC2.28 33.55,9.42 33.66,9.53 v34.54,9.53
  Bottom 0.203: E1.4 23.75,5.27 24.38,5.91 26.61,5.91 28.02,4.5 32.24,4.5 33.08,5.33 33.08,8.97 33.64,9.53 v34.54,9.53
FAU_1
  Top 0.305: R1.2 U1.18
FAU_2
  Top 0.305: R6.2 U5.18
GND  (via drill 0.35)
  Top 0.203: 21.53,12 C12.2 19.24,10.86 21.02,9.08 C11.1 | 21.53,12 C13.2 | Q2.2 21.53,12 | 19.51,15.06 LED1.C
  Top 0.305: IC2.35 33.24,12.92 33.4,13.08 33.4,16.8 33.12,17.08 C7.1 32.64,17.27 34.1,18.73 v34.23,18.73 | IC2.47 26.96,14.82 26.86,14.92 C10.1 25.91,16.51 C14.1 27.43,17.14 v27.62,17.34 28.51,17.34 28.97,16.88 28.97,15.2 28.46,14.69 IC2.44 | IC2.23 31.46,6.58 31.62,6.41 31.62,4.25 | 31.62,4.25 C6.1 32.89,4.25 33.53,4.89 C2.2 34.67,4.89 34.86,5.08 35.86,5.08 U2.7 36.83,5.08 37.08,5.33 v38.16,5.33 | C16.1 31.62,4.25 | IC2.8 23.55,9.92 22.72,9.08 C11.1 22.23,8.95 v22.23,7.75 | C21.2 22.61,5.91 22.42,5.72 U7.7 20.31,5.72 19.94,6.1 v19.94,6.41 | U6.7 2.02,5.07 1.84,4.89 C22.2 v1.14,3.94 | U3.7 55.25,5.72 55.44,5.91 C1.2 v56.96,5.91 | v49.53,3.68 48.79,4.42 U3.4 | U7.4 16.02,4.42 v16.64,3.81 | U2.4 40.34,6.37 v40.32,6.35 | U6.4 7.39,6.37 v7.37,6.35 | 19.51,15.06 S2.1 19.51,18.07 18.92,18.66 v18.48,18.66 | TP6.TP 32.58,1.46 31.88,2.16 v31.11,2.16
  Bottom 0.305: E1.2 24.75,3.95 24.84,3.86 26.21,3.86 v26.54,4.19 | E0.2 35.75,4 36.01,3.75 37.85,3.75 v38.16,4.06 | v27.62,17.34 27.62,17.3 27.28,16.95 PRO1.4 | IIC2.3 12.3,17.57 12.89,18.16 v12.89,18.29 | SS2.3 44.31,17.26 45.34,18.29 v45.34,18.8 | SS1.3 37.64,18.16 37.07,18.73 v35.81,18.73 | v17.46,18.67 17.46,18.29 17.72,18.03 18.8,18.03 18.99,17.84 18.99,16.97 IIC1.3
  other vias: 51.31,20.57 50.04,20.57 50.67,20.57 50.29,19.94 50.93,19.94 51.56,19.94 49.97,19.3 50.61,19.3 51.94,20.51 52.45,21.02 51.75,21.15
  pour Bottom (no thermals): 53.59,19.24 53.59,20.45 52.51,21.53 50.16,21.53 49.59,20.95 49.59,19.05 49.72,18.92 50.99,18.92 51.31,19.24
  pour Route2 (no thermals): 51.5,18.03 51.5,19.24 53.15,20.89 53.15,21.53 52.83,21.84 0.64,21.84 0.19,21.4 0.19,3.68 0.51,3.37 15.81,3.37 15.94,3.24 23.3,3.24 23.69,3.62 28.07,3.62 30.29,1.4 32.38,1.4 34.16,3.17 55.56,3.17 57.91,5.52 57.91,6.99 57.47,7.43 42.93,7.43 42.55,7.05 34.73,7.05 34.16,6.48 23.18,6.48 22.8,6.86 22.8,8 22.42,8.38 19.68,8.38 17.91,6.6 8.38,6.6 7.81,7.18 3.56,7.18 2.48,8.26 2.48,15.37 4.89,17.78 25.97,17.78 27.05,16.7 28,16.7 28.96,17.65 51.12,17.65
  pour Route2 (no thermals): 51.5,19.43 53.15,19.43 55.18,17.4 55.18,8.19 54.29,7.3 54.29,4.32 54.93,3.68 59.69,3.68 59.88,3.87 59.88,21.4 59.44,21.84 51.94,21.84 51.5,21.4
IN_U_1
  Top 0.203: IC2.29 33.83,9.92 35.28,11.37 35.28,15.24 38.1,18.06 40.83,18.06 41.13,17.76 U1.27
IN_U_2
  Top 0.203: U5.27 8.17,17.76 10.71,20.3 27.46,20.3 30.45,17.3 IC2.40
IN_V_1
  Top 0.203: IC2.30 33.71,10.42 34.98,11.69 34.98,15.37 37.97,18.36 41.85,18.36 42.43,17.78 U1.25
IN_V_2
  Top 0.203: U5.25 9.47,17.74 11.7,19.96 27.36,19.96 30.09,17.23 30.09,14.75 29.96,14.63 IC2.41
IN_W_1
  Top 0.203: IC2.31 33.59,10.92 34.67,12 34.67,15.49 37.85,18.67 42.74,18.67 43.73,17.68 U1.23
IN_W_2
  Top 0.203: U5.23 10.77,17.72 12.7,19.65 27.22,19.65 29.71,17.15 29.71,14.88 29.46,14.63 IC2.42
LED_1
  Top 0.203: IC2.2 25.31,12.92 24.77,13.46 24.77,14.1 23.88,14.99 R9.1
MOT_U_1  (via drill 0.35)
  Top 0.406: U2.2 43.38,5.07 43.75,4.7 R2.2
  other vias: 33.97,0.57 34.67,0.57 35.37,0.57 34.35,1.21 35.05,1.21 35.75,1.21 33.97,1.84 34.67,1.84 35.37,1.84 34.29,2.48 34.99,2.48 35.69,2.48 36.39,2.48 36.07,1.84 36.07,0.57 36.45,1.21
  pour Top (no thermals): 42.93,4.51 44.58,4.51 44.77,4.32 44.77,3.24 44.58,3.05 42.86,3.05 41.21,1.4 41.21,0.25 41.08,0.13 33.72,0.13 33.59,0.25 33.59,2.67 33.85,2.92 38.67,2.92 39.75,4 42.42,4
  pour Bottom (no thermals): 34.1,2.92 33.63,2.45 33.63,0.37 33.87,0.13 41.59,0.13 41.94,0.47 41.94,2.06 42.18,2.3 44.02,2.3 44.39,2.67 44.39,5.8 44.32,5.87 43.84,5.87 43.8,5.83 43.8,3.8 43.69,3.68 41.08,3.68 40.45,3.05 40.45,2.03 40.26,1.84 37.08,1.84 36.83,2.1 36.83,2.67 36.58,2.92
MOT_U_2  (via drill 0.35)
  Top 0.406: U6.2 10.42,5.07 10.79,4.7 R7.2
  other vias: 0.57,0.57 1.4,0.57 2.2,0.57 0.95,1.14 1.78,1.14 2.6,1.14 0.57,1.71 1.4,1.71 2.2,1.71 0.95,2.29 1.84,2.29 2.6,2.29 0.57,2.86 1.4,2.86 2.18,2.86 2.98,0.57 2.98,1.71 2.98,2.86
  pour Top (no thermals): 9.97,4.51 11.62,4.51 11.68,4.45 11.68,3.24 11.62,3.17 10.1,3.17 8.38,1.46 8.38,0.25 8.26,0.13 0.25,0.13 0.13,0.25 0.13,3.17 0.32,3.37 5.71,3.37 6.35,4 9.46,4
  pour Bottom (no thermals): 10.79,5.84 10.86,5.91 11.37,5.91 11.43,5.84 11.43,2.86 10.86,2.29 9.21,2.29 8.95,2.03 8.95,0.95 8.13,0.13 0.32,0.13 0.13,0.32 0.13,3.17 0.32,3.37 3.24,3.37 3.56,3.05 3.56,2.48 3.81,2.22 6.67,2.22 8.26,3.81 10.54,3.81 10.79,4.06
MOT_U_UP_1
  Top 0.406: U2.3 43.38,5.72 43.75,6.1 R2.1
  pour Top (no thermals): 42.86,11.87 42.86,6.35 42.93,6.29 44.58,6.29 44.83,6.54 44.83,8.06 44.58,8.32 44.58,9.02 43.28,10.31 43.28,11.87
MOT_U_UP_2
  Top 0.406: U6.3 10.42,5.72 10.79,6.1 R7.1
  pour Top (no thermals): 9.92,11.87 9.92,6.4 10.03,6.29 11.75,6.29 11.87,6.41 11.87,8 11.62,8.26 11.62,9.22 10.33,10.52 10.33,11.87
MOT_V_1  (via drill 0.35)
  Top 0.406: U3.3 46.79,5.07 46.42,4.7 R3.2
  other vias: 50.86,0.51 50.16,0.51 49.47,0.51 48.77,0.51 49.34,1.21 49.97,1.21 50.67,1.21 48.64,1.21 50.86,1.91 50.16,1.91 49.53,1.91 48.83,1.91 48.64,2.6 49.34,2.6 50.04,2.6 50.67,2.6
  pour Top (no thermals): 45.59,4.51 45.34,4.25 45.34,3.43 44.77,2.86 42.99,2.86 41.47,1.33 41.47,0.25 41.59,0.13 51.12,0.13 51.24,0.25 51.24,2.67 50.86,3.05 48.32,3.05 47.88,3.49 47.88,3.87 47.24,4.51
  pour Bottom (no thermals): 44.83,5.87 44.77,5.8 44.77,2.6 45.09,2.29 48.13,2.29 48.26,2.16 48.26,0.19 48.32,0.13 51.12,0.13 51.24,0.25 51.24,2.67 50.86,3.05 49.28,3.05 48.73,3.59 45.87,3.59 45.4,4.06 45.4,5.82 45.35,5.87
MOT_V_2  (via drill 0.35)
  Top 0.406: U7.3 13.84,5.07 13.46,4.7 R8.2
  other vias: 16.51,0.57 17.14,0.57 17.78,0.57 17.46,1.14 16.76,1.14 16.51,1.71 17.14,1.71 17.78,1.71 16.83,2.29 17.53,2.29 16.51,2.79 17.21,2.79 15.81,0.57 16.13,1.14 15.81,1.71 16.13,2.29 15.81,2.79
  pour Top (no thermals): 12.64,4.51 14.29,4.51 14.92,3.87 14.92,3.49 15.24,3.17 17.72,3.17 18.22,2.67 18.22,0.32 18.03,0.13 8.83,0.13 8.7,0.25 8.7,1.4 10.22,2.92 11.94,2.92 12.45,3.43 12.45,4.32
  pour Bottom (no thermals): 11.81,5.84 11.87,5.91 12.38,5.91 12.45,5.84 12.45,4.19 12.89,3.75 15.81,3.75 16.34,3.21 17.49,3.21 18.22,2.48 18.22,0.38 17.97,0.13 15.43,0.13 15.24,0.32 15.24,2.16 15.11,2.29 12.64,2.29 11.81,3.11
MOT_V_UP_1
  Top 0.406: U3.2 46.79,5.72 46.42,6.1 R3.1
  pour Top (no thermals): 44.83,11.87 44.83,8.38 45.09,8.13 45.09,6.48 45.28,6.29 47.24,6.29 47.37,6.41 47.37,7.68 45.21,9.84 45.21,11.87
MOT_V_UP_2
  Top 0.406: U7.2 13.84,5.72 13.46,6.1 R8.1
  pour Top (no thermals): 11.87,11.87 11.87,8.32 12.13,8.06 12.13,6.41 12.26,6.29 14.29,6.29 14.41,6.41 14.41,7.62 12.28,9.75 12.28,11.87
MOT_W_1  (via drill 0.35)
  other vias: 59.31,0.57 58.61,0.57 57.91,0.57 57.21,0.57 57.53,1.21 58.23,1.21 58.93,1.21 57.15,1.84 57.85,1.84 58.55,1.84 59.25,1.84 57.47,2.48 58.17,2.48 58.86,2.48 57.78,3.11 58.48,3.11 59.18,3.11 57.09,3.11
  pour Top (no thermals): 45.49,11.87 45.49,9.88 48.58,6.79 49.34,6.79 49.53,6.6 49.53,4.7 51.5,2.73 51.5,0.25 51.63,0.13 59.63,0.13 59.82,0.32 59.82,3.37 59.56,3.62 53.47,3.62 51.63,5.46 51.63,6.67 49.53,8.76 48.13,8.76 46.55,10.35 46.04,10.35 45.89,10.5 45.89,11.87
  pour Bottom (no thermals): 56.96,3.56 59.37,3.56 59.75,3.17 59.75,0.51 59.44,0.19 52.13,0.19 51.5,0.83 51.5,2.79 50.04,4.25 49.28,4.25 48.9,3.87 46.16,3.87 45.78,4.25 45.78,5.84 45.85,5.91 46.35,5.91 46.55,5.71 51.37,5.71 53.53,3.56 53.53,2.54 53.85,2.22 56.45,2.22 56.64,2.41 56.64,3.24
MOT_W_2  (via drill 0.35)
  other vias: 24.13,0.64 24.83,0.64 25.59,0.64 24.45,1.33 25.21,1.33 25.97,1.33 24.13,1.97 24.89,1.97 25.65,1.97 24.45,2.54 25.21,2.54 25.97,2.54 24.07,3.11 24.83,3.11 25.59,3.11
  pour Top (no thermals): 12.55,11.87 12.93,11.87 12.93,10.44 13.02,10.35 13.4,10.35 15.18,8.57 16.83,8.57 18.73,6.67 18.73,5.46 20.57,3.62 26.16,3.62 26.42,3.37 26.42,0.38 26.16,0.13 18.67,0.13 18.48,0.32 18.48,2.79 16.64,4.64 16.64,6.6 16.45,6.79 15.56,6.79 12.55,9.8
  pour Bottom (no thermals): 12.89,5.91 12.83,5.84 12.83,4.32 13.08,4.06 15.75,4.06 16.07,4.38 17.08,4.38 18.48,2.98 18.48,0.38 18.73,0.13 25.65,0.13 26.35,0.83 26.35,2.98 25.84,3.49 23.88,3.49 23.62,3.24 23.62,2.16 23.24,1.78 20.51,1.78 20.38,1.91 20.38,3.56 18.16,5.78 13.53,5.78 13.4,5.91
N$1
  Top 0.305: IC2.22 30.96,6.58 30.86,6.48 C16.2
N$2
  Top 0.305: C17.1 7.49,11.21 U5.1
N$3
  Top 0.305: C3.1 40.45,11.21 U1.1
N$4
  Top 0.305: C3.2 39.69,12.15 40.84,12.15 41.13,11.87 U1.2
N$5
  Top 0.305: C4.1 41.11,10.27 41.37,10.27 41.78,10.69 U1.3
N$6
  Bottom 0.305: R10.2 56.06,10.48 LED2.A
N$7
  Top 0.305: C17.2 5.91,11.26 6.79,12.15 7.83,12.15 8.17,11.8 U5.2
N$8
  Top 0.305: C18.1 7.47,9.53 8.22,10.27 8.41,10.27 8.82,10.69 U5.3
N$9
  Top 0.203: R9.2 LED1.A
N$10  (via drill 2)
  other vias: 31.11,19.81
N$11  (via drill 2)
  other vias: 2.29,19.81
PA4
  Top 0.203: IC2.14 26.96,4.66 27.24,4.38 27.24,1.02 TP1.TP
PA5
  Top 0.203: IC2.15 27.46,4.72 27.61,4.57 27.61,2.36 TP2.TP
PA6
  Top 0.203: IC2.16 27.96,2.65 28.82,1.79 29.87,1.79 30.83,0.83 TP3.TP
RST  (via drill 0.2)
  Top 0.203: IC2.7 24.71,10.42 v24.63,10.5 | C14.2 R4.1 23.41,17.57 S2.2 23.41,16.97 24.54,15.84 24.54,15.26 25.39,14.42 v25.4,14.42
  Bottom 0.203: v25.4,14.42 24.62,13.64 v24.62,10.5 v24.63,10.5
RX_2  (via drill 0.2)
  Top 0.203: IC2.13 26.46,6.96 26.24,6.74 25.21,6.74 v25.02,6.93
  Bottom 0.203: v25.02,6.93 25.16,6.79 31.56,6.79 32.11,7.34 32.11,9.42 33.48,10.79 34.54,10.79 35.81,12.06 35.81,15.11 36.64,15.94 SS1.2
RX_6  (via drill 0.2)
  Top 0.203: IC2.33 33.47,11.92 34.06,12.51 34.06,15.75 37.59,19.28 41.38,19.28 41.92,19.82 42.73,19.82 v43.31,19.24
  Bottom 0.203: SS2.2 v43.31,19.24
SCL_1  (via drill 0.2)
  Top 0.203: v28.34,16.32 28.59,16.06 28.59,15.39 27.96,14.75 IC2.45
  Bottom 0.203: v28.34,16.32 27.99,16.32 27.22,15.56 18.35,15.56 17.97,15.94 IIC1.2
SCL_2  (via drill 0.2)
  Top 0.203: IC2.21 30.46,6.58 30.16,6.29 v30.02,6.29
  Bottom 0.203: IIC2.2 11.3,15.68 12.38,14.61 23.11,14.61 24.07,13.65 24.07,7.05 24.83,6.29 v30.02,6.29
SDA_1  (via drill 0.2)
  Top 0.203: IC2.46 27.46,14.89 28,15.43 v28,15.62
  Bottom 0.203: v28,15.62 27.63,15.25 17.64,15.25 16.95,15.94 16.95,16.94 IIC1.1
SDA_2  (via drill 0.2)
  Top 0.203: IC2.39 30.96,15.28 v30.99,15.3
  Bottom 0.203: IIC2.1 10.3,17.99 11.3,18.99 13.4,18.99 17.44,14.95 30.63,14.95 v30.99,15.3
SWCLK  (via drill 0.2)
  Top 0.203: IC2.37 31.96,15.42 v31.82,15.56
  Bottom 0.203: PRO1.3 25.71,16.07 25.91,15.88 27.05,15.88 28.07,16.89 28.77,16.89 29.72,15.94 31.44,15.94 v31.82,15.56
SWDIO  (via drill 0.2)
  Top 0.203: IC2.34 33.5,12.42 33.76,12.68 33.76,15.95 34.02,16.21 v34.02,16.53
  Bottom 0.203: PRO1.2 24.71,17.79 24.95,18.03 28.45,18.03 29.27,17.21 33.34,17.21 v34.02,16.53
TX_2  (via drill 0.2)
  Top 0.203: IC2.12 25.77,7.42 v25.7,7.36
  Bottom 0.203: v25.7,7.36 26.1,7.36 26.3,7.15 31.43,7.15 31.79,7.51 31.79,9.56 33.34,11.11 34.42,11.11 35.45,12.14 35.45,16.76 SS1.1
TX_6  (via drill 0.2)
  Top 0.203: IC2.32 33.53,11.42 34.37,12.26 34.37,15.62 37.72,18.97 41.78,18.97 42.06,19.25 v42.32,19.25
  Bottom 0.203: SS2.1 42.31,19.24 v42.32,19.25
V3P3_1
  Top 0.305: U1.17 U1.16 U1.15 | U1.15 50.48,16.85 C5.1 | R1.1 48.93,18.3 U1.15
V3P3_2
  Top 0.305: U5.17 U5.16 U5.15 | U5.15 17.53,16.85 C19.1 | R6.1 15.97,18.29 U5.15
VCC  (via drill 0.35)
  Top 0.305: IC2.36 32.66,15.54 C7.2 v31.69,16.51 | 26.01,14.12 25.76,13.86 IC2.1 | 26.01,14.12 26.01,14.88 C10.2 25.34,16.13 24.51,16.95 R4.2 24.51,17.72 24.77,17.97 26.53,17.97 26.85,18.29 v26.85,18.68 | IC2.48 26.01,14.12 | IC2.24 31.96,6.78 32.32,6.41 C6.2 32.89,5.78 33.53,6.41 C2.1 | IC2.9 24.21,9.42 C11.2 23.37,8.57 v23.37,7.75 | U7.6 U7.5 | U7.5 23.07,4.42 C21.1 | U6.6 U6.5 2.87,6.41 C22.1 v1.14,7.37 | U3.6 U3.5 56.03,4.42 C1.1 v57.72,4.38 | C2.1 35.82,6.41 U2.5 U2.6 | C2.1 v34.1,7.43 | U7.5 20.41,4.42 19.94,4.89 v19.94,5.14
  Bottom 0.305: E1.1 25.58,4.95 v26.04,4.95 | E0.1 36.26,4.64 v37.4,4.64 | PRO1.1 23.71,17.8 24.58,18.68 v26.85,18.68
  Bottom 0.508: C29.2 55.94,15.81 U4.2
  Bottom 1.016: U4.4 U4.2
  other vias: 46.8,19.62 47.43,19.62 48.07,19.62 48.7,19.62 47.05,20.26 47.69,20.26 48.32,20.26 48.96,20.26 49.72,18.16 50.36,18.16 50.99,18.16
  pour Bottom (no thermals): 49.66,14.03 49.66,17.53 49.85,17.72 51.18,17.72 51.46,18 51.46,18.43 51.21,18.68 49.61,18.68 49.35,18.94 49.35,20.43 49.15,20.64 46.74,20.64 46.44,20.35 46.44,19.34 47.5,18.29 47.5,14.03
  pour Route15: 50.93,17.34 33.27,17.34 32.77,16.83 32.77,16.13 32.64,16 29.65,16 28.89,16.76 24.57,16.76 23.43,15.62 16.95,15.62 16.45,16.13 3.24,16.13 2.35,15.24 2.35,7.94 4.57,5.71 18.1,5.71 18.8,6.41 22.42,6.41 22.8,6.79 22.8,7.94 23.18,8.32 23.81,8.32 24.13,8 24.13,6.73 24.57,6.29 32.7,6.29 33.08,6.67 33.08,7.18 33.91,8 34.54,8 34.8,7.75 34.8,6.6 35.24,6.16 39.12,6.16 39.62,5.65 45.72,5.65 47.18,7.11 58.74,7.11 59.44,6.41 59.44,4.38 58.74,3.68 52.2,3.68 51.63,3.11 26.42,3.11 25.91,3.62 21.21,3.62 20.83,3.24 3.68,3.24 2.48,4.45 0.64,4.45 0.25,4.83 0.25,21.15 0.89,21.78 53.28,21.78 53.78,21.27 53.78,20.26 52.77,19.24 51.82,19.24 51.63,19.05 51.63,18.03
  pour Route15: 52.51,19.49 55.75,16.26 55.75,8.06 54.61,6.92 54.61,3.68 59.44,3.68 59.44,21.34 58.99,21.78 53.21,21.78 53.09,21.65 53.09,20.64 52.77,20.32 52.58,20.32 52.51,20.26
VM  (via drill 0.35)
  Bottom 0.305: R10.1 54.8,13.49 U4.3
  Bottom 0.508: C28.2 58.04,15.94 55.6,13.5 U4.3
  other vias: 16.89,11.75 17.53,11.75 18.22,11.75 17.21,11.11 17.91,11.11 15.49,9.21 16.13,9.21 16.76,9.21 17.4,9.21 18.1,9.21 18.73,9.21 15.81,9.78 16.45,9.78 17.02,9.78 17.72,9.78 18.41,9.78 19.11,9.78 3.05,11.49 3.75,11.49 4.45,11.49 3.37,10.99 4.06,10.99 3.62,7.94 4.25,7.94 4.89,7.94 5.52,7.94 6.16,7.94 6.79,7.94 7.43,7.94 8.06,7.94 8.7,7.94 9.27,7.94 36.13,11.56 36.83,11.56 37.53,11.56 36.46,11.01 37.15,11.01 36.32,7.62 36.96,7.62 37.59,7.62 38.23,7.62 38.86,7.62 39.5,7.62 40.13,7.62 40.77,7.62 41.4,7.62 42.04,7.62 3.94,8.57 3.3,8.57 36.64,8.26 37.27,8.26 50.61,11.81 51.31,11.81 52.01,11.81 52.64,11.81 53.34,11.81 50.16,11.24 50.86,11.24 51.56,11.24 52.2,11.24 52.9,11.24 53.59,11.24 50.36,10.67 51.05,10.67 51.75,10.67 52.45,10.67 53.15,10.67 51.31,8.76 52.01,8.76 52.7,8.76 53.34,8.76 53.98,8.76 51.75,8.13 52.39,8.13 53.09,8.13 53.72,8.13 54.29,8.13 53.78,12.26 51.63,9.4 52.32,9.4 53.02,9.4 53.72,9.4
  pour Top (no thermals): 13.84,11.87 14.22,11.87 14.22,10.6 14.48,10.35 16.19,10.35 16.38,10.54 16.38,11.87 16.7,12.19 18.54,12.19 18.67,12.06 18.67,11.05 19.49,10.22 19.49,9.27 19.01,8.79 15.28,8.79 13.84,10.22
  pour Top (no thermals): 9.65,11.87 9.65,7.81 9.4,7.56 3.43,7.56 2.73,8.26 2.73,11.68 2.92,11.87 4.57,11.87 4.76,11.68 4.76,9.14 5.02,8.89 8.38,8.89 8.57,9.08 8.57,10.03 8.7,10.03 9.27,10.6 9.27,11.87
  pour Top (no thermals): 46.8,11.87 46.8,10.35 48.2,8.95 50.36,8.95 51.63,7.68 59.82,7.68 59.94,7.81 59.94,10.17 59.87,10.25 57.06,10.25 55.97,11.34 55.97,14.5 55.87,14.61 54.36,14.61 54.23,14.48 54.23,13.27 53.21,12.26 50.42,12.26 49.59,11.43 49.59,10.6 49.28,10.29 47.43,10.29 47.18,10.54 47.18,11.87
  pour Top (no thermals): 42.29,11.87 42.55,11.87 42.61,11.81 42.61,7.18 42.35,6.92 36.07,6.92 35.69,7.3 35.69,11.75 35.94,12 37.72,12 38.04,11.68 38.04,9.02 38.29,8.76 40.96,8.76 41.21,9.02 41.21,9.72 41.5,10.01 41.76,10.01 42.23,10.48 42.23,11.81
  pour Bottom (no thermals): 55.88,14.03 55.88,13.46 55.18,12.76 55.18,11.62 54.23,11.62 53.98,11.37 53.98,10.92 53.34,10.29 50.16,10.29 49.78,10.67 49.78,11.62 50.36,12.19 53.02,12.19 53.72,12.89 53.72,14.03
  pour Route15: 55.18,15.43 55.18,8.38 54.48,7.68 43.18,7.68 42.48,6.99 36.07,6.99 35.62,7.43 35.62,9.27 34.86,10.03 33.78,10.03 33.34,9.59 33.34,8 32.13,6.79 26.99,6.79 26.61,7.18 26.61,8.13 26.23,8.51 19.68,8.51 18.67,7.49 3.3,7.49 2.67,8.13 2.67,11.75 3.05,12.13 14.99,12.13 15.18,11.94 16.07,11.94 16.32,12.19 16.32,14.22 17.34,15.24 24.83,15.24 24.96,15.11 30.29,15.11 30.61,14.8 33.46,14.8 35.43,16.76 51.56,16.76 52.39,15.94 54.67,15.94

### Text on the board
tPlace: RST | CURR_SEN_V1 | DRV_V3 / PS_21_09 | AGND | VM | P123/G | M1 | M0
bPlace: 2MM | DC-DC / 3V3 | Brushless_DRV_V3 / Current_sen_V1 / PS_21_09